# Altium schematic sheet esp32_devkit.SchDoc
size A4; SheetNumber: 3; SheetTotal: 3
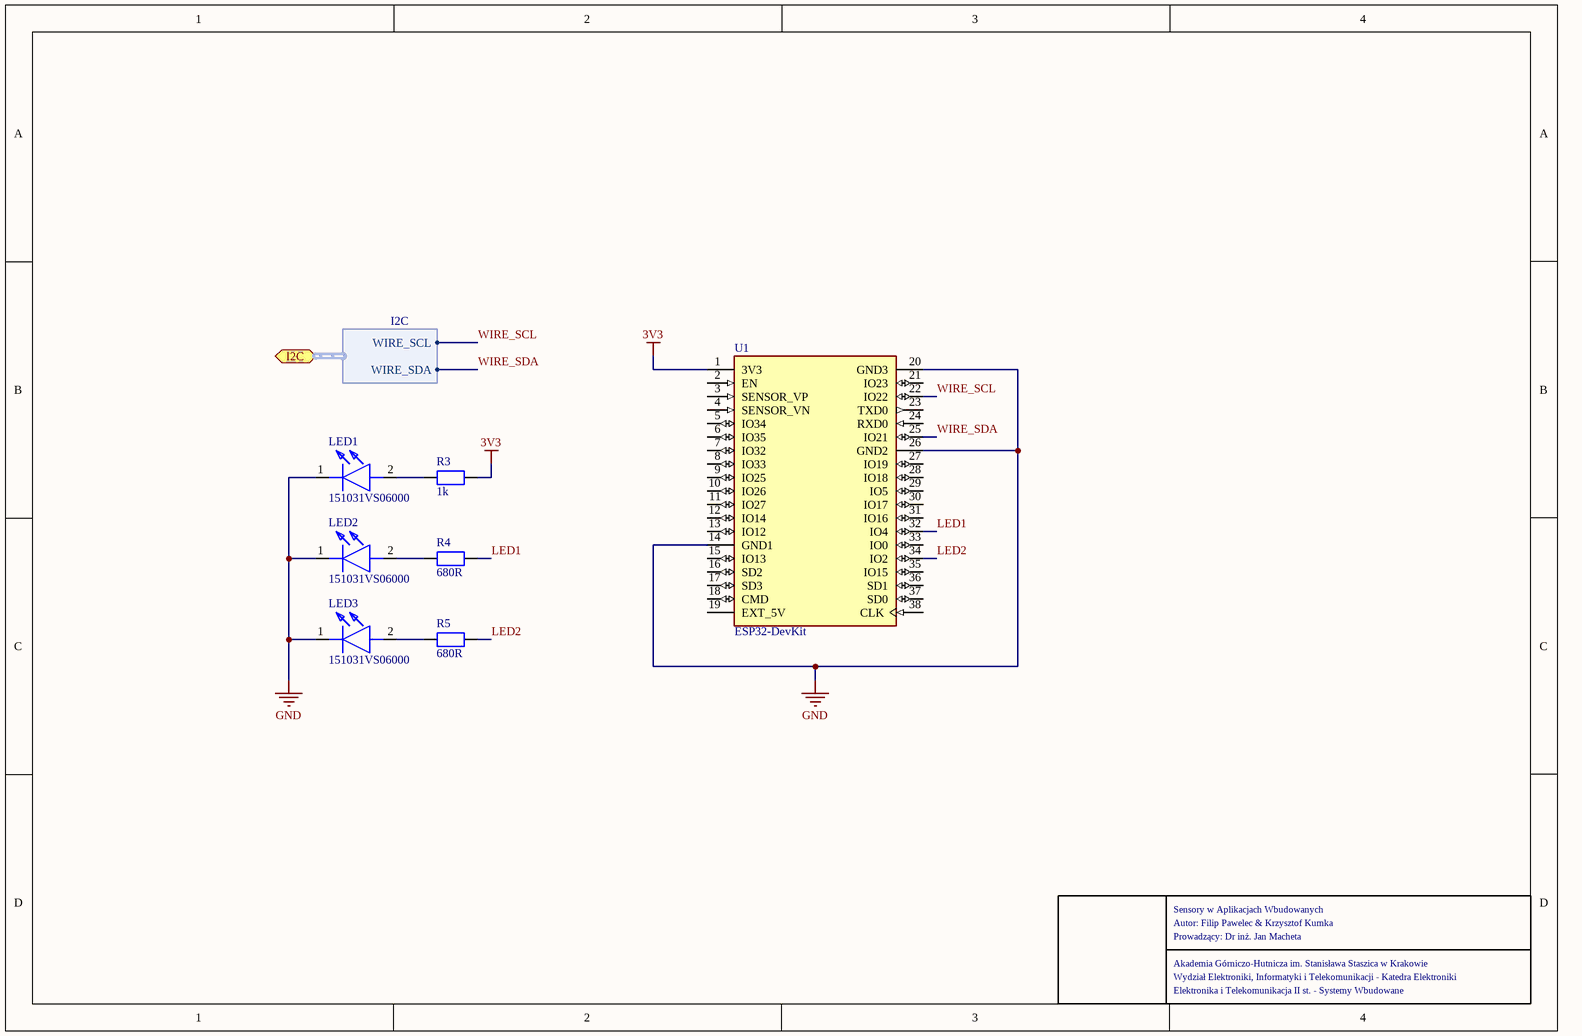
[diagram p0: esp32_devkit.SchDoc]

## Parts
LED1  151031VS06000  [151034GS03000]
LED2  151031VS06000  [151034GS03000]
LED3  151031VS06000  [151034GS03000]
R3  1k  [R0603]
R4  680R  [R0603]
R5  680R  [R0603]
U1  ESP32-DevKit  [MODULE_ESP32-DEVKIT]

## Ports
I2C (bidir, harness I2C)

## Harnesses
I2C: WIRE_SCL, WIRE_SDA

## Nets
3V3: R3.2 U1.1(3V3)
GND: LED1.1(K) LED2.1(K) LED3.1(K) U1.14(GND1) U1.20(GND3) U1.26(GND2)
LED1: R4.2 U1.32(IO4)
LED2: R5.2 U1.34(IO2)
WIRE_SCL: U1.22(IO22) ; port I2C.WIRE_SCL
WIRE_SDA: U1.25(IO21) ; port I2C.WIRE_SDA
NetLED1_2: LED1.2(A) R3.1
NetLED2_2: LED2.2(A) R4.1
NetLED3_2: LED3.2(A) R5.1

Not connected (* = marked no-connect by the designer): U1 2(EN) 3(SENSOR_VP) 4(SENSOR_VN) 5(IO34) 6(IO35) 7(IO32) 8(IO33) 9(IO25) 10(IO26) 11(IO27) 12(IO14) 13(IO12) 15(IO13) 16(SD2) 17(SD3) 18(CMD) 19(EXT_5V) 21(IO23) 23(TXD0) 24(RXD0) 27(IO19) 28(IO18) 29(IO5) 30(IO17) 31(IO16) 33(IO0) 35(IO15) 36(SD1) 37(SD0) 38(CLK)

## Notes on the sheet
- Autor: Filip Pawelec & Krzysztof Kumka
- Sensory w Aplikacjach Wbudowanych
- Akademia Górniczo-Hutnicza im. Stanisława Staszica w Krakowie
- Prowadzący: Dr inż. Jan Macheta
- Wydział Elektroniki, Informatyki i Telekomunikacji - Katedra Elektroniki
- Elektronika i Telekomunikacja II st. - Systemy Wbudowane

## Library data of the parts
LED1-LED3 = 151031VS06000: LED; Manufacturer_Name: Wurth Elektronik; Datasheet Link: https://componentsearchengine.com//151031VS06000.pdf; Mouser2 Part Number: 710-151031VS06000; Mouser2 Price/Stock: https://www.mouser.com/Search/Refine.aspx?Keyword=710-151031VS06000; Manufacturer_Part_Number: 151031VS06000
R3-R5 = R0603: Resistor
  R3: value: 1k
  R4 R5: value: 680R
U1 = ESP32_DEVKIT: ESP32-DevKitC-32UE